# Altium schematic sheet 2_MCU.SchDoc
size A3; DocumentNumber: 3; SheetNumber: 3; SheetTotal: 6; PageSetup: Record=PageOptions|CenterHorizontal=True|CenterVertical=True|PrintScale=1.01|XCorrection=1.00|YCorrection=1.00|PrintKind=0|BorderSize=5000000|LeftOffset=0|BottomOffset=0|Orientation=2|PaperLength=1000|PaperWidth=1000|Scale=100|PaperSource=7|PrintQuality=-4|MediaType=1|DitherType=10|PaperKind=A3|PrintScaleMode=1
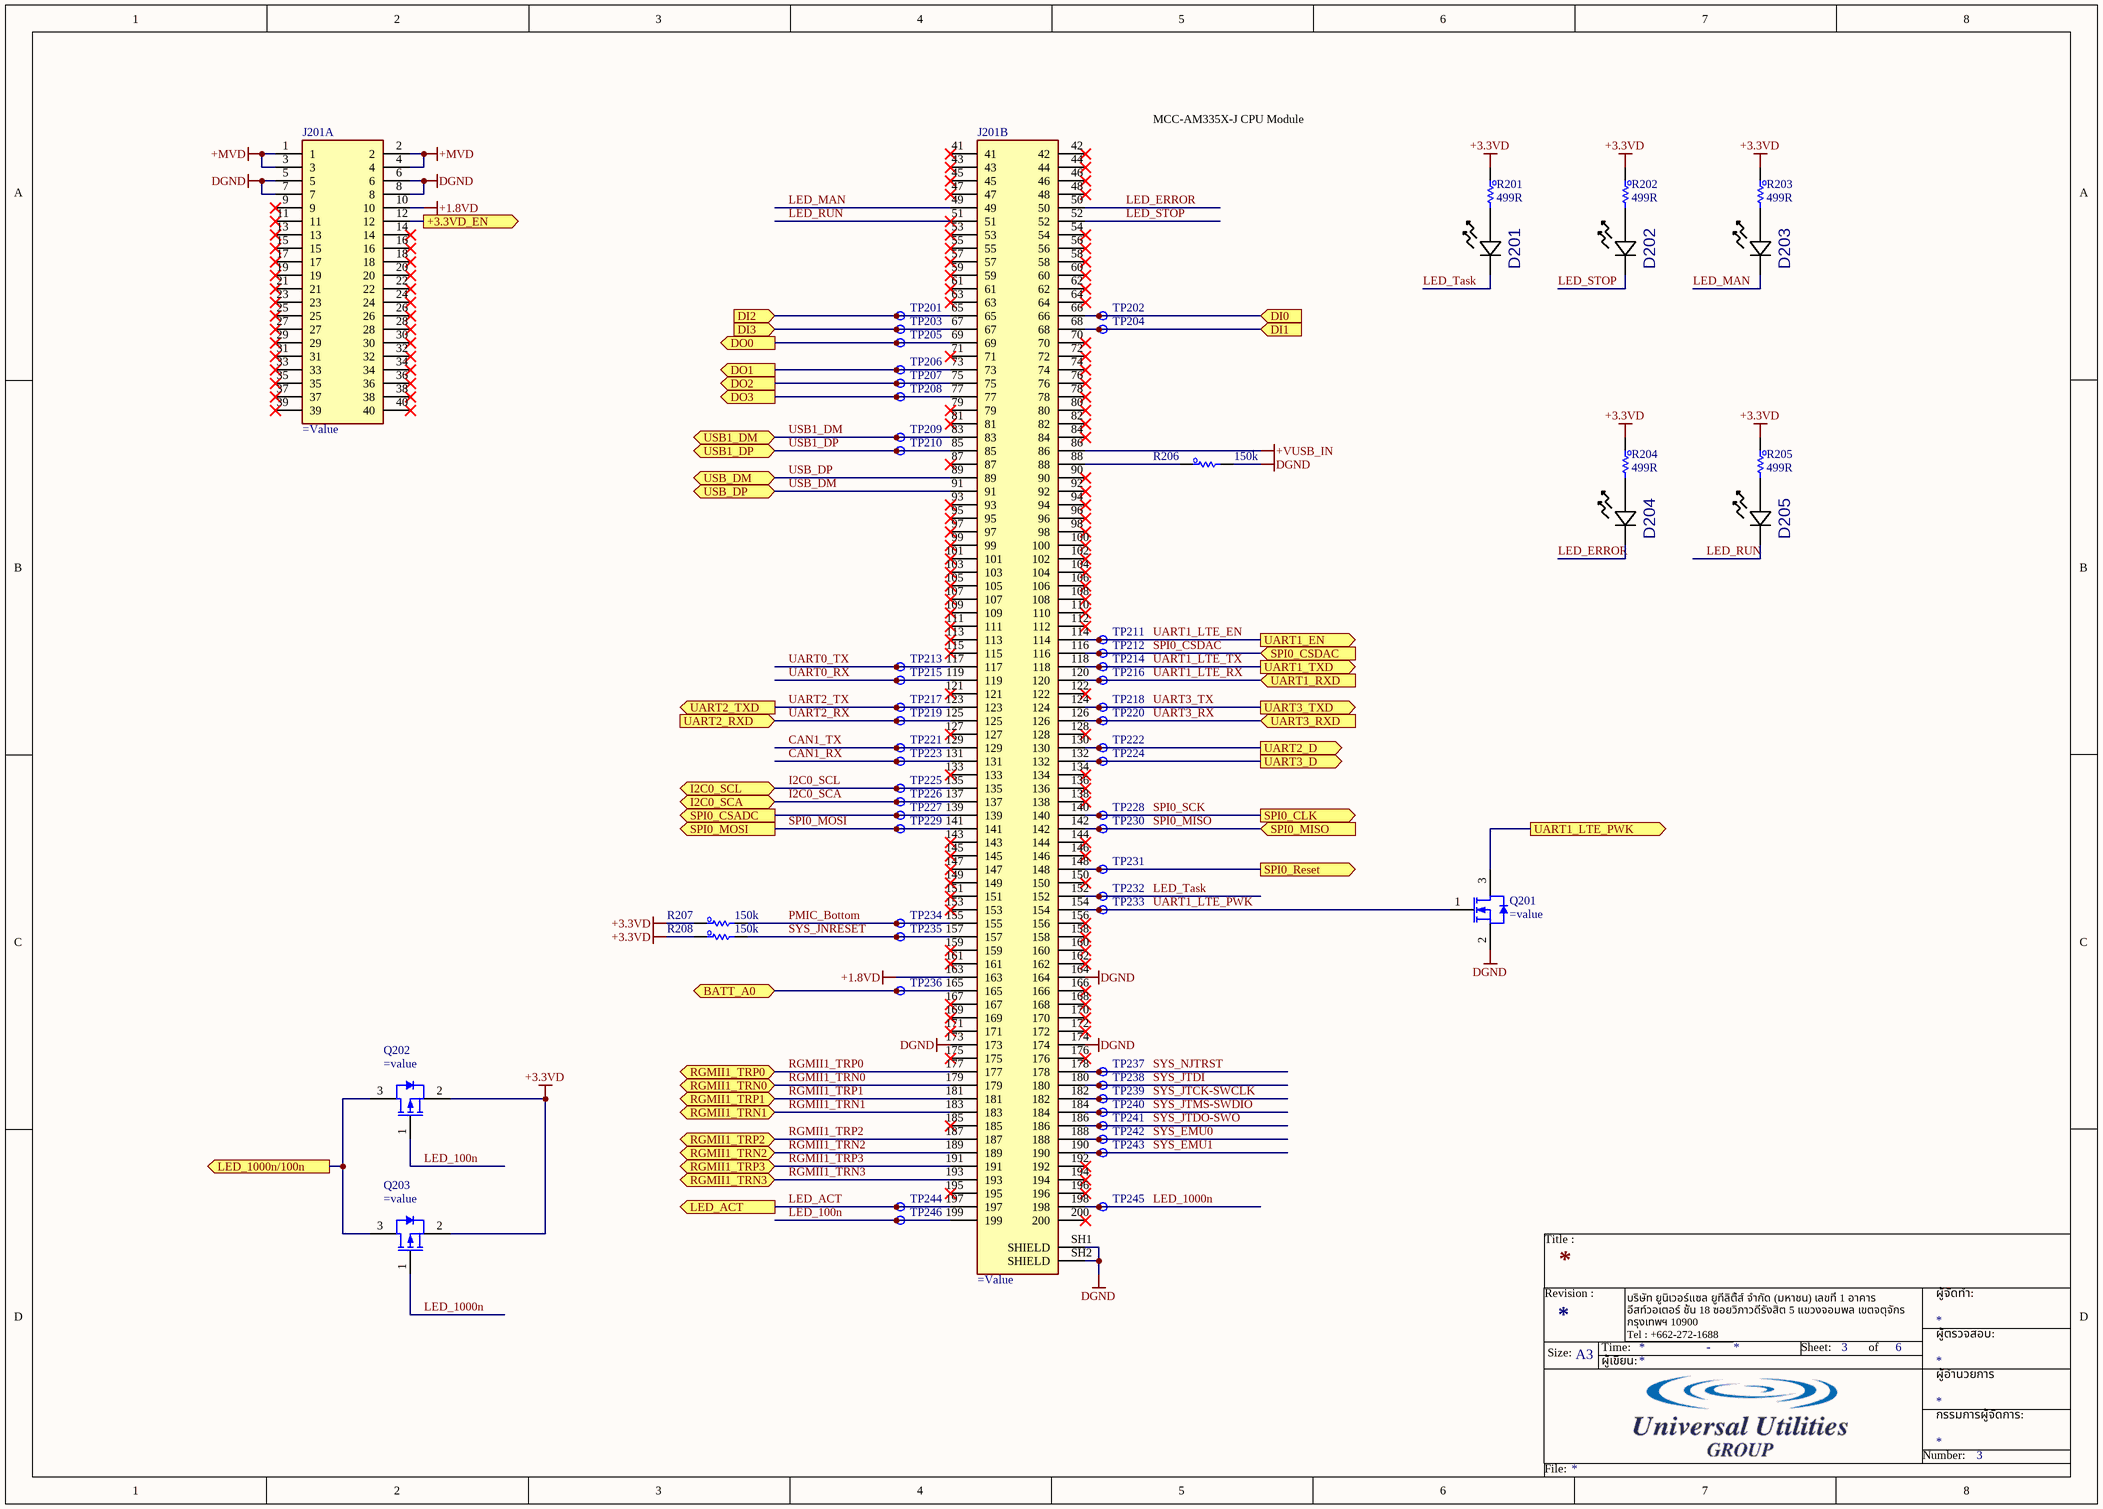
[diagram p0: 2_MCU.SchDoc]

## Parts
D201  (no value)  [LED_0VS75000_WRE]
D202  (no value)  [LED_0VS75000_WRE]
D203  (no value)  [LED_0VS75000_WRE]
D204  (no value)  [LED_0VS75000_WRE]
D205  (no value)  [LED_0VS75000_WRE]
J201  (no value)  [TE_1473149-4]  (parts A,B of 2)
Q201  (no value)  [SOT95P245X110-3M]
Q202  (no value)  [SOT95P245X110-3M]
Q203  (no value)  [SOT95P245X110-3M]
R201  499R  [R_0603]
R202  499R  [R_0603]
R203  499R  [R_0603]
R204  499R  [R_0603]
R205  499R  [R_0603]
R206  150k  [R_0603]
R207  150k  [R_0603]
R208  150k  [R_0603]
TP201  (no value)  [TP_Testpoint]  (no BOM)
TP202  (no value)  [TP_Testpoint]  (no BOM)
TP203  (no value)  [TP_Testpoint]  (no BOM)
TP204  (no value)  [TP_Testpoint]  (no BOM)
TP205  (no value)  [TP_Testpoint]  (no BOM)
TP206  (no value)  [TP_Testpoint]  (no BOM)
TP207  (no value)  [TP_Testpoint]  (no BOM)
TP208  (no value)  [TP_Testpoint]  (no BOM)
TP209  (no value)  [TP_Testpoint]  (no BOM)
TP210  (no value)  [TP_Testpoint]  (no BOM)
TP211  (no value)  [TP_Testpoint]  (no BOM)
TP212  (no value)  [TP_Testpoint]  (no BOM)
TP213  (no value)  [TP_Testpoint]  (no BOM)
TP214  (no value)  [TP_Testpoint]  (no BOM)
TP215  (no value)  [TP_Testpoint]  (no BOM)
TP216  (no value)  [TP_Testpoint]  (no BOM)
TP217  (no value)  [TP_Testpoint]  (no BOM)
TP218  (no value)  [TP_Testpoint]  (no BOM)
TP219  (no value)  [TP_Testpoint]  (no BOM)
TP220  (no value)  [TP_Testpoint]  (no BOM)
TP221  (no value)  [TP_Testpoint]  (no BOM)
TP222  (no value)  [TP_Testpoint]  (no BOM)
TP223  (no value)  [TP_Testpoint]  (no BOM)
TP224  (no value)  [TP_Testpoint]  (no BOM)
TP225  (no value)  [TP_Testpoint]  (no BOM)
TP226  (no value)  [TP_Testpoint]  (no BOM)
TP227  (no value)  [TP_Testpoint]  (no BOM)
TP228  (no value)  [TP_Testpoint]  (no BOM)
TP229  (no value)  [TP_Testpoint]  (no BOM)
TP230  (no value)  [TP_Testpoint]  (no BOM)
TP231  (no value)  [TP_Testpoint]  (no BOM)
TP232  (no value)  [TP_Testpoint]  (no BOM)
TP233  (no value)  [TP_Testpoint]  (no BOM)
TP234  (no value)  [TP_Testpoint]  (no BOM)
TP235  (no value)  [TP_Testpoint]  (no BOM)
TP236  (no value)  [TP_Testpoint]  (no BOM)
TP237  (no value)  [TP_Testpoint]  (no BOM)
TP238  (no value)  [TP_Testpoint]  (no BOM)
TP239  (no value)  [TP_Testpoint]  (no BOM)
TP240  (no value)  [TP_Testpoint]  (no BOM)
TP241  (no value)  [TP_Testpoint]  (no BOM)
TP242  (no value)  [TP_Testpoint]  (no BOM)
TP243  (no value)  [TP_Testpoint]  (no BOM)
TP244  (no value)  [TP_Testpoint]  (no BOM)
TP245  (no value)  [TP_Testpoint]  (no BOM)
TP246  (no value)  [TP_Testpoint]  (no BOM)

## Ports
+3.3VD_EN (out), BATT_A0 (bidir), DI0 (in), DI1 (in), DI2 (in), DI3 (in), DO0 (out), DO1 (out), DO2 (out), DO3 (out), I2C0_SCA (bidir), I2C0_SCL (bidir), LED_1000n/100n (out), LED_ACT (out), RGMII1_TRN0 (bidir), RGMII1_TRN1 (bidir), RGMII1_TRN2 (bidir), RGMII1_TRN3 (bidir), RGMII1_TRP0 (bidir), RGMII1_TRP1 (bidir), RGMII1_TRP2 (bidir), RGMII1_TRP3 (bidir), SPI0_CLK (out), SPI0_CSADC (out), SPI0_CSDAC (in), SPI0_MISO (in), SPI0_MOSI (out), SPI0_Reset (out), UART1_EN (out), UART1_LTE_PWK (out), UART1_RXD (in), UART1_TXD (out), UART2_D (out), UART2_RXD (in), UART2_TXD (out), UART3_D (out), UART3_RXD (in), UART3_TXD (out), USB1_DM (bidir), USB1_DP (bidir), USB_DM (bidir), USB_DP (bidir)

## Nets
+1.8VD: J201.10 J201.163
+3.3VD: Q202.2(S) Q203.2(S) R201.1 R202.1 R203.1 R204.1 R205.1 R207.1 R208.1
+MVD: J201.1 J201.2 J201.3 J201.4
+VUSB_IN: J201.86
DGND: J201.5 J201.6 J201.7 J201.8 J201.164 J201.173 J201.174 J201.SH1(SHIELD) J201.SH2(SHIELD) Q201.2(S) R206.2
+3.3VD_EN: J201.12 ; port +3.3VD_EN
BATT_A0: J201.165 TP236.1 ; port BATT_A0
CAN1_RX: J201.131 TP223.1
CAN1_TX: J201.129 TP221.1
DI0: J201.66 TP202.1 ; port DI0
DI1: J201.68 TP204.1 ; port DI1
DI2: J201.65 TP201.1 ; port DI2
DI3: J201.67 TP203.1 ; port DI3
DO0: J201.69 TP205.1 ; port DO0
DO1: J201.73 TP206.1 ; port DO1
DO2: J201.75 TP207.1 ; port DO2
DO3: J201.77 TP208.1 ; port DO3
I2C0_SCA: J201.137 TP226.1 ; port I2C0_SCA
I2C0_SCL: J201.135 TP225.1 ; port I2C0_SCL
LED_100n: J201.199 Q202.1(G) TP246.1
LED_1000n: J201.198 Q203.1(G) TP245.1
LED_1000n/100n: Q202.3(D) Q203.3(D) ; port LED_1000n/100n
LED_ACT: J201.197 TP244.1 ; port LED_ACT
LED_ERROR: D204.1 J201.50
LED_MAN: D203.1 J201.49
LED_RUN: D205.1 J201.51
LED_STOP: D202.1 J201.52
LED_Task: D201.1 J201.152 TP232.1
PMIC_Bottom: J201.155 R207.2 TP234.1
RGMII1_TRN0: J201.179 ; port RGMII1_TRN0
RGMII1_TRN1: J201.183 ; port RGMII1_TRN1
RGMII1_TRN2: J201.189 ; port RGMII1_TRN2
RGMII1_TRN3: J201.193 ; port RGMII1_TRN3
RGMII1_TRP0: J201.177 ; port RGMII1_TRP0
RGMII1_TRP1: J201.181 ; port RGMII1_TRP1
RGMII1_TRP2: J201.187 ; port RGMII1_TRP2
RGMII1_TRP3: J201.191 ; port RGMII1_TRP3
SPI0_CSADC: J201.139 TP227.1 ; port SPI0_CSADC
SPI0_CSDAC: J201.116 TP212.1 ; port SPI0_CSDAC
SPI0_MISO: J201.142 TP230.1 ; port SPI0_MISO
SPI0_MOSI: J201.141 TP229.1 ; port SPI0_MOSI
SPI0_Reset: J201.148 TP231.1 ; port SPI0_Reset
SPI0_SCK: J201.140 TP228.1 ; port SPI0_CLK
SYS_EMU0: J201.188 TP242.1
SYS_EMU1: J201.190 TP243.1
SYS_JNRESET: J201.157 R208.2 TP235.1
SYS_JTCK-SWCLK: J201.182 TP239.1
SYS_JTDI: J201.180 TP238.1
SYS_JTDO-SWO: J201.186 TP241.1
SYS_JTMS-SWDIO: J201.184 TP240.1
SYS_NJTRST: J201.178 TP237.1
UART0_RX: J201.119 TP215.1
UART0_TX: J201.117 TP213.1
UART1_LTE_EN: J201.114 TP211.1 ; port UART1_EN
UART1_LTE_PWK: J201.154 Q201.1(G) TP233.1
UART1_LTE_PWK: Q201.3(D) ; port UART1_LTE_PWK  [a separate net that carries the same name]
UART1_LTE_RX: J201.120 TP216.1 ; port UART1_RXD
UART1_LTE_TX: J201.118 TP214.1 ; port UART1_TXD
UART2_D: J201.130 TP222.1 ; port UART2_D
UART2_RX: J201.125 TP219.1 ; port UART2_RXD
UART2_TX: J201.123 TP217.1 ; port UART2_TXD
UART3_D: J201.132 TP224.1 ; port UART3_D
UART3_RX: J201.126 TP220.1 ; port UART3_RXD
UART3_TX: J201.124 TP218.1 ; port UART3_TXD
USB1_DM: J201.83 TP209.1 ; port USB1_DM
USB1_DP: J201.85 TP210.1 ; port USB1_DP
USB_DM: J201.91 ; port USB_DP
USB_DP: J201.89 ; port USB_DM
NetD201_2: D201.2 R201.2
NetD202_2: D202.2 R202.2
NetD203_2: D203.2 R203.2
NetD204_2: D204.2 R204.2
NetD205_2: D205.2 R205.2
NetJ201_88: J201.88 R206.1

Not connected (* = marked no-connect by the designer): J201 9* 11* 13* 14* 15* 16* 17* 18* 19* 20* 21* 22* 23* 24* 25* 26* 27* 28* 29* 30* 31* 32* 33* 34* 35* 36* 37* 38* 39* 40* 41* 42* 43* 44* 45* 46* 47* 48* 53* 54* 55* 56* 57* 58* 59* 60* 61* 62* 63* 64* 70* 71* 72* 74* 76* 78* 79* 80* 81* 82* 84* 87* 90* 92* 93* 94* 95* 96* 97* 98* 99* 100* 101* 102* 103* 104* 105* 106* 107* 108* 109* 110* 111* 112* 113* 115* 121* 122* 127* 128* 133* 134* 136* 138* 143* 144* 145* 146* 147* 149* 150* 151* 153* 156* 158* 159* 160* 161* 162* 166* 167* 168* 169* 170* 171* 172* 175* 176* 185* 192* 194* 195* 196* 200*

## Notes on the sheet
- MCC-AM335X-J CPU Module
- Title :
- Revision :
- ผู้จัดทำ:
- Size:
- A3
- Time:
- ผู้เขียน:
- บริษัท ยูนิเวอร์แซล ยูทีลิตี้ส์ จำกัด (มหาชน) เลขที่ 1 อาคาร อีสท์วอเตอร์ ชั้น 18 ซอยวิภาวดีรังสิต 5 แขวงจอมพล เขตจตุจักร กรุงเทพฯ 10900
  Tel : +662-272-1688
  Fax :+662-2721690-1
- -
- Sheet:
- of
- ผู้อำนวยการ
- ผู้ตรวจสอบ:
- Number:
- กรรมการผู้จัดการ:
- File:

## Library data of the parts
D201-D205 = D_LED_150060BS75000: LED BLUE CLEAR 0603 SMD; Manufacturer: Wurth Electronics; Value: 150060VS75000; PackageReference: 0603; PartID: 732-4980-1-ND; PartNumber: 150060VS75000
J201 = CON_DDR2: CONN SKT SODIMM 200POS R/A SMD; PartNumber: 1473149-4; Manufacturer: TE Connectivity AMP Connectors; Value: 1473149-4; PartID: A114854-ND; PackageReference: *; Value2: *; Value3: *
Q201 = Q_NMOS_2N7002H: MOSFET N-CH 60V 300MA SOT23-3; Manufacturer: Infineon Technologies; Value: 2N7002H6327XTSA2; PackageReference: SOT23; PartID: 2N7002H6327XTSA2CT-ND; PartNumber: 2N7002H6327XTSA2; Value3: *
Q202 Q203 = Q_PMOS_BSS84: MOSFET P-CH 60V 170MA SOT23-3; Manufacturer: Infineon Technologies; Value: BSS84PH6327XTSA2; PackageReference: SOT23; PartID: BSS84PH6327XTSA2CT-ND; PartNumber: BSS84PH6327XTSA2; Value3: *
R201-R205 = R_Resister: RES 499 OHM 1% 1/10W 0603; Manufacturer: Vishay Dale; PartNumber: CRCW0603499RFKEAC; Value2: 0.1W; Value: 499R; PackageReference: 0603; PartID: 541-3986-1-ND; Value3: *
R206-R208 = R_Resister: RES SMD 150K OHM 1% 1/10W 0603; Manufacturer: Vishay Dale; PartNumber: CRCW0603150KFKEAC; Value2: 0.1W; Value: 150k; PackageReference: 0603; PartID: 541-4034-1-ND; Value3: *
TP201-TP246 = TP_TestPoint: TestPoint; Manufacturer: *; PackageReference: *; PartID: *; PartNumber: *; Value2: *; Value3: *